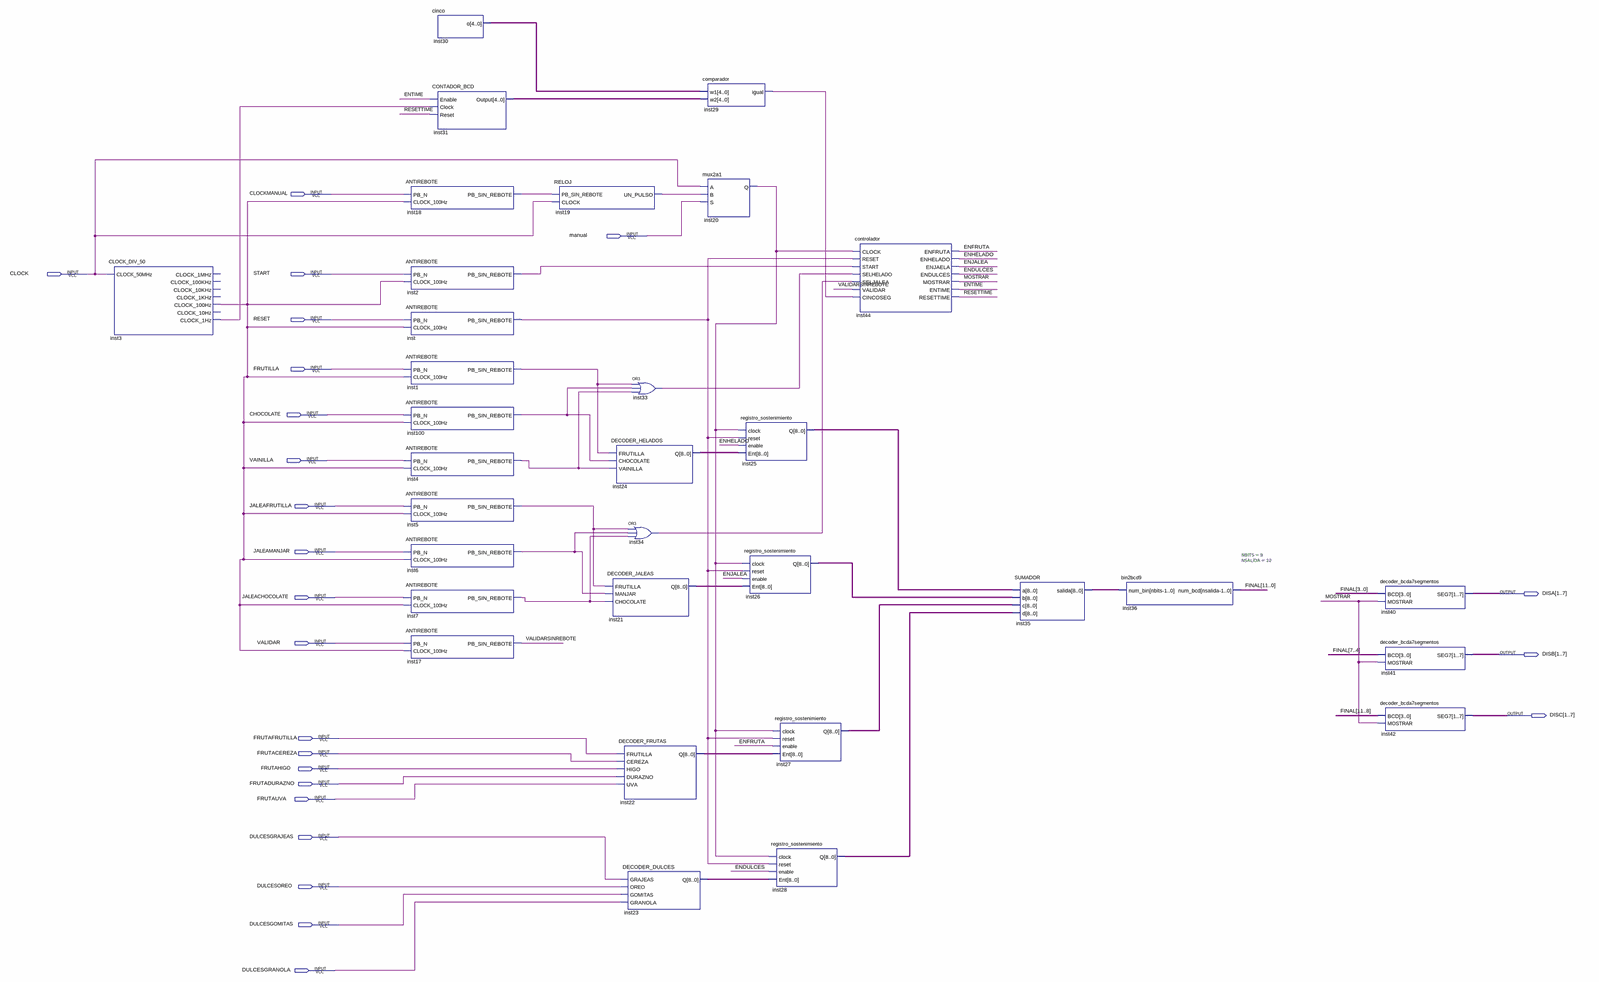
[diagram p0: schematic sheet, whole]
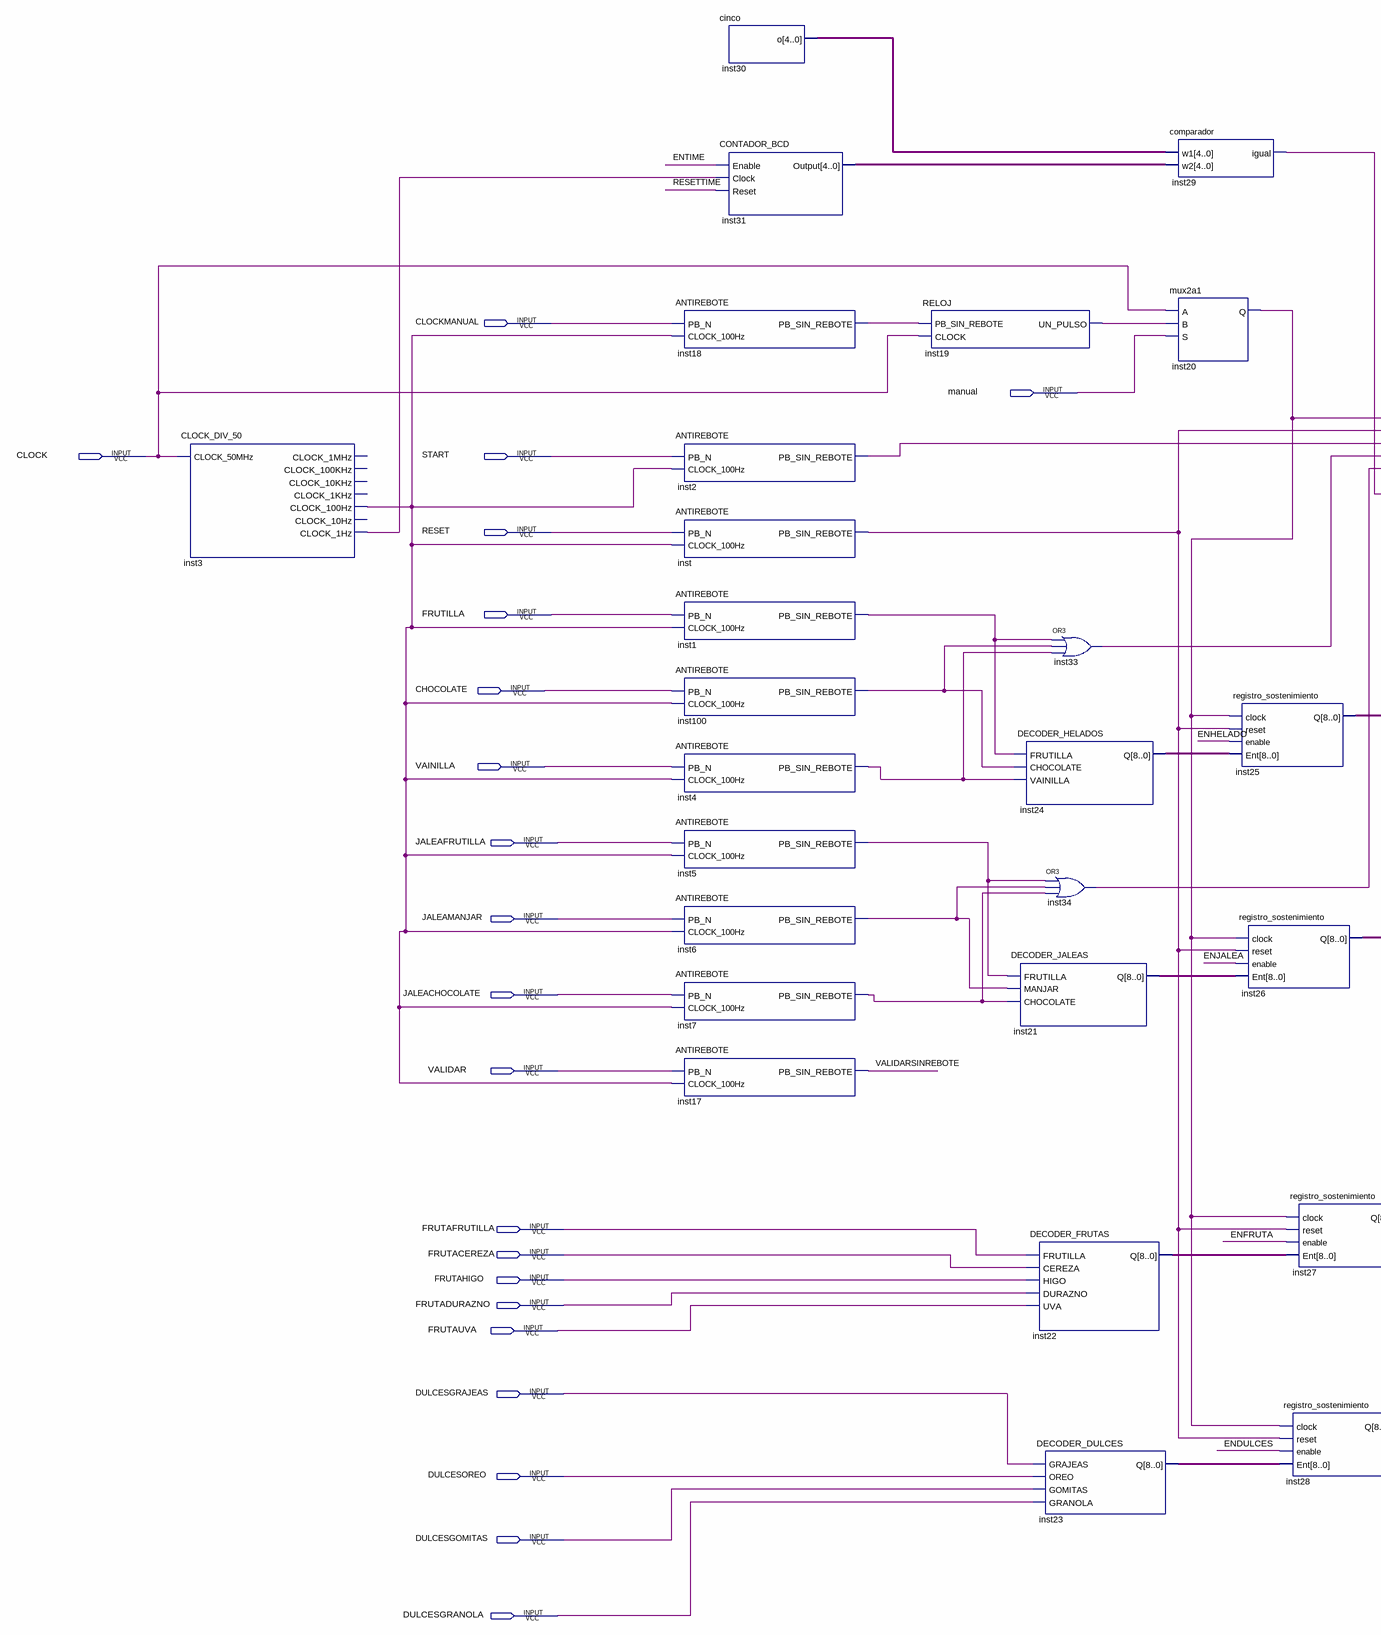
[diagram p1: schematic sheet, left part]
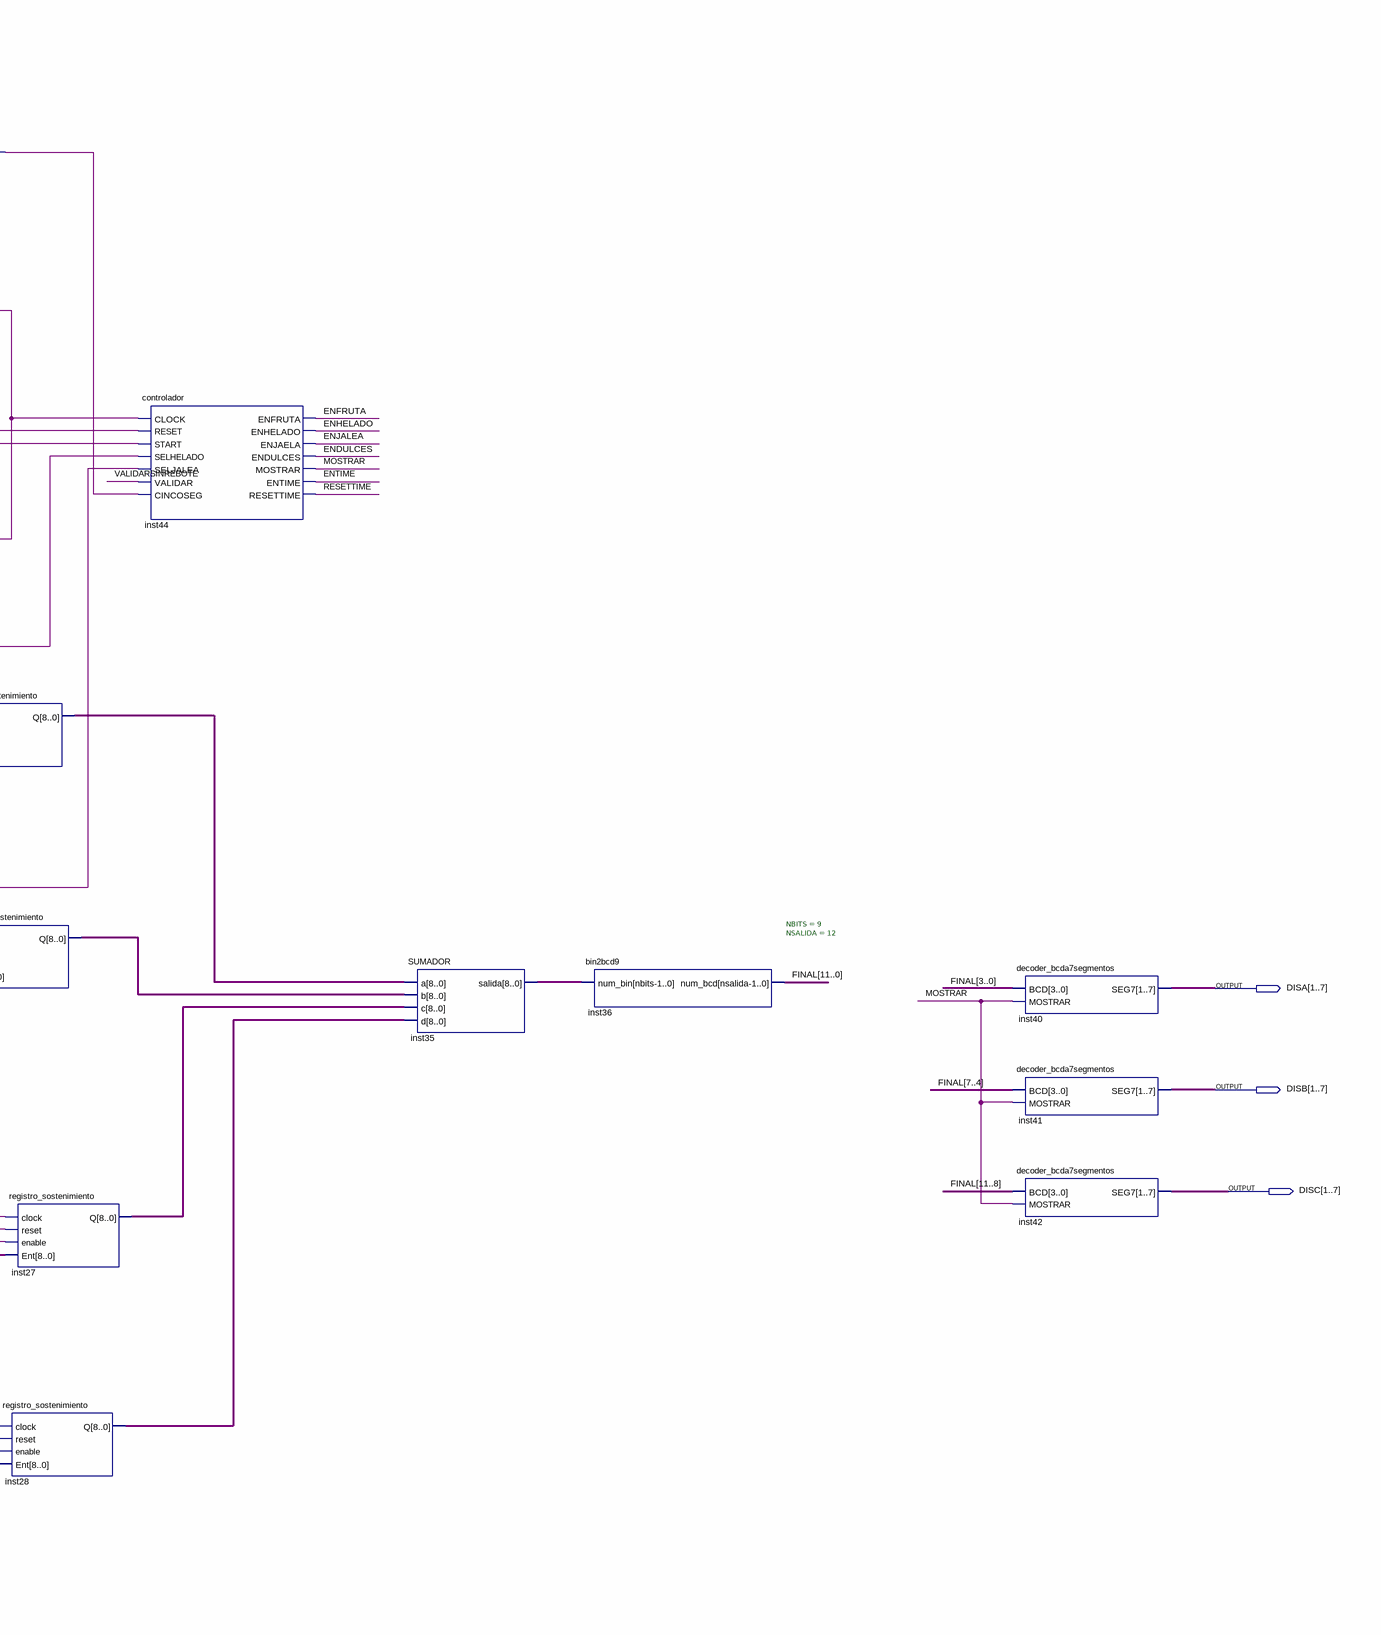
[diagram p2: schematic sheet, right part]
// Quartus schematic heladosSA.bdf as structural Verilog: 32 symbols, 24 pins
module heladosSA (
  input  CLOCKMANUAL,
  input  manual,
  input  CLOCK,
  input  START,
  input  RESET,
  input  FRUTILLA,
  input  CHOCOLATE,
  input  VAINILLA,
  input  JALEAFRUTILLA,
  input  JALEAMANJAR,
  input  JALEACHOCOLATE,
  input  VALIDAR,
  input  FRUTAFRUTILLA,
  input  FRUTACEREZA,
  input  FRUTAHIGO,
  input  FRUTADURAZNO,
  input  FRUTAUVA,
  input  DULCESGRAJEAS,
  input  DULCESOREO,
  input  DULCESGOMITAS,
  input  DULCESGRANOLA,
  output [1:7] DISA,
  output [1:7] DISB,
  output [1:7] DISC
);

  wire ENDULCES, ENFRUTA, ENHELADO, ENJALEA, ENTIME, inst1_pb_sin_rebote, inst2_pb_sin_rebote,
       inst3_clock_1hz, inst3_clock_100hz, inst4_pb_sin_rebote, inst5_pb_sin_rebote, inst6_pb_sin_rebote,
       inst7_pb_sin_rebote, inst18_pb_sin_rebote, inst19_un_pulso, inst20_q, inst29_igual, inst33_out,
       inst34_out, inst100_pb_sin_rebote, inst_pb_sin_rebote, MOSTRAR, RESETTIME, VALIDARSINREBOTE;
  wire [4:0] inst30_o, inst31_output;
  wire [8:0] inst21_q, inst22_q, inst23_q, inst24_q, inst25_q, inst26_q, inst27_q, inst28_q, inst35_salida;
  wire [11:0] FINAL;

  CLOCK_DIV_50 inst3 (
    .CLOCK_50MHz(CLOCK), .CLOCK_100Hz(inst3_clock_100hz), .CLOCK_1Hz(inst3_clock_1hz));  // open: CLOCK_1MHz, CLOCK_100KHz, CLOCK_10KHz, CLOCK_1KHz, CLOCK_10Hz
  ANTIREBOTE inst18 (.PB_N(CLOCKMANUAL), .CLOCK_100Hz(inst3_clock_100hz), .PB_SIN_REBOTE(inst18_pb_sin_rebote));
  ANTIREBOTE inst2 (.PB_N(START), .CLOCK_100Hz(inst3_clock_100hz), .PB_SIN_REBOTE(inst2_pb_sin_rebote));
  ANTIREBOTE inst (.PB_N(RESET), .CLOCK_100Hz(inst3_clock_100hz), .PB_SIN_REBOTE(inst_pb_sin_rebote));
  ANTIREBOTE inst1 (.PB_N(FRUTILLA), .CLOCK_100Hz(inst3_clock_100hz), .PB_SIN_REBOTE(inst1_pb_sin_rebote));
  ANTIREBOTE inst100 (.PB_N(CHOCOLATE), .CLOCK_100Hz(inst3_clock_100hz), .PB_SIN_REBOTE(inst100_pb_sin_rebote));
  ANTIREBOTE inst4 (.PB_N(VAINILLA), .CLOCK_100Hz(inst3_clock_100hz), .PB_SIN_REBOTE(inst4_pb_sin_rebote));
  ANTIREBOTE inst5 (.PB_N(JALEAFRUTILLA), .CLOCK_100Hz(inst3_clock_100hz), .PB_SIN_REBOTE(inst5_pb_sin_rebote));
  ANTIREBOTE inst6 (.PB_N(JALEAMANJAR), .CLOCK_100Hz(inst3_clock_100hz), .PB_SIN_REBOTE(inst6_pb_sin_rebote));
  ANTIREBOTE inst7 (.PB_N(JALEACHOCOLATE), .CLOCK_100Hz(inst3_clock_100hz), .PB_SIN_REBOTE(inst7_pb_sin_rebote));
  ANTIREBOTE inst17 (.PB_N(VALIDAR), .CLOCK_100Hz(inst3_clock_100hz), .PB_SIN_REBOTE(VALIDARSINREBOTE));
  cinco inst30 (.o(inst30_o));
  CONTADOR_BCD inst31 (.Enable(ENTIME), .Clock(inst3_clock_1hz), .Reset(RESETTIME), .Output(inst31_output));
  RELOJ inst19 (.PB_SIN_REBOTE(inst18_pb_sin_rebote), .CLOCK(CLOCK), .UN_PULSO(inst19_un_pulso));
  DECODER_JALEAS inst21 (
    .FRUTILLA(inst5_pb_sin_rebote), .MANJAR(inst6_pb_sin_rebote), .CHOCOLATE(inst7_pb_sin_rebote),
    .Q(inst21_q));
  or inst33 (inst33_out, inst1_pb_sin_rebote, inst100_pb_sin_rebote, inst4_pb_sin_rebote);
  DECODER_HELADOS inst24 (
    .FRUTILLA(inst1_pb_sin_rebote), .CHOCOLATE(inst100_pb_sin_rebote), .VAINILLA(inst4_pb_sin_rebote),
    .Q(inst24_q));
  or inst34 (inst34_out, inst5_pb_sin_rebote, inst6_pb_sin_rebote, inst7_pb_sin_rebote);
  DECODER_FRUTAS inst22 (
    .FRUTILLA(FRUTAFRUTILLA), .CEREZA(FRUTACEREZA), .HIGO(FRUTAHIGO), .DURAZNO(FRUTADURAZNO), .UVA(FRUTAUVA),
    .Q(inst22_q));
  DECODER_DULCES inst23 (
    .GRAJEAS(DULCESGRAJEAS), .OREO(DULCESOREO), .GOMITAS(DULCESGOMITAS), .GRANOLA(DULCESGRANOLA), .Q(inst23_q));
  comparador inst29 (.w1(inst30_o), .w2(inst31_output), .igual(inst29_igual));
  mux2a1 inst20 (.A(CLOCK), .B(inst19_un_pulso), .S(manual), .Q(inst20_q));
  registro_sostenimiento inst25 (
    .clock(inst20_q), .reset(inst_pb_sin_rebote), .enable(ENHELADO), .Ent(inst24_q), .Q(inst25_q));
  registro_sostenimiento inst26 (
    .clock(inst20_q), .reset(inst_pb_sin_rebote), .enable(ENJALEA), .Ent(inst21_q), .Q(inst26_q));
  registro_sostenimiento inst27 (
    .clock(inst20_q), .reset(inst_pb_sin_rebote), .enable(ENFRUTA), .Ent(inst22_q), .Q(inst27_q));
  registro_sostenimiento inst28 (
    .clock(inst20_q), .reset(inst_pb_sin_rebote), .enable(ENDULCES), .Ent(inst23_q), .Q(inst28_q));
  controlador inst44 (
    .CLOCK(inst20_q), .RESET(inst_pb_sin_rebote), .START(inst2_pb_sin_rebote), .SELHELADO(inst33_out),
    .SELJALEA(inst34_out), .VALIDAR(VALIDARSINREBOTE), .CINCOSEG(inst29_igual), .ENFRUTA(ENFRUTA),
    .ENHELADO(ENHELADO), .ENJAELA(ENJALEA), .ENDULCES(ENDULCES), .MOSTRAR(MOSTRAR), .ENTIME(ENTIME),
    .RESETTIME(RESETTIME));
  SUMADOR inst35 (.a(inst25_q), .b(inst26_q), .c(inst27_q), .d(inst28_q), .salida(inst35_salida));
  bin2bcd9 #(.NBITS(9), .NSALIDA(12)) inst36 (.num_bin(inst35_salida), .num_bcd(FINAL));
  decoder_bcda7segmentos inst40 (.BCD(FINAL[3:0]), .MOSTRAR(MOSTRAR), .SEG7(DISA));
  decoder_bcda7segmentos inst41 (.BCD(FINAL[7:4]), .MOSTRAR(MOSTRAR), .SEG7(DISB));
  decoder_bcda7segmentos inst42 (.BCD(FINAL[11:8]), .MOSTRAR(MOSTRAR), .SEG7(DISC));
endmodule
